# Altium schematic sheet XC7A35TFTG256_bank34.SchDoc
size A4; DocumentNumber: 19; SheetNumber: 19; SheetTotal: 21; SheetName: FPGA Bank 34
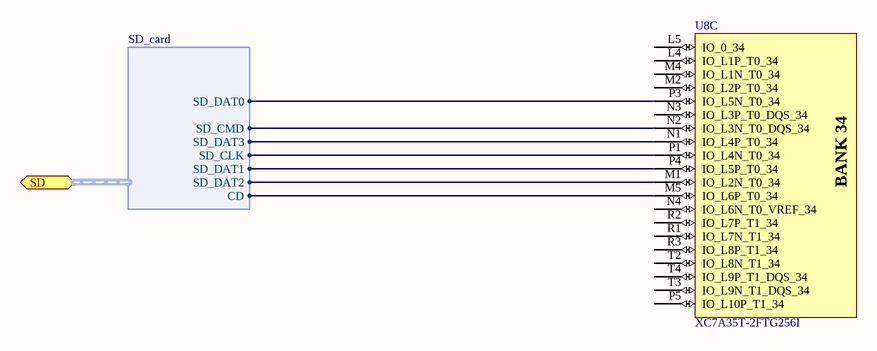
[diagram p0: XC7A35TFTG256_bank34.SchDoc]

## Parts
U8  XC7A35T-2FTG256I  [FTG256]  (part C of 8)

## Ports
SD (harness SD_card)

## Harnesses
SD_card: SD_CMD, SD_CLK, SD_DAT0, SD_DAT1, SD_DAT2, SD_DAT3, CD

## Nets
NetU8_M1: U8.M1(IO_L2N_T0_34) ; port SD.SD_DAT2
NetU8_M5: U8.M5(IO_L6P_T0_34) ; port SD.CD
NetU8_N1: U8.N1(IO_L4P_T0_34) ; port SD.SD_DAT3
NetU8_N2: U8.N2(IO_L3N_T0_DQS_34) ; port SD.SD_CMD
NetU8_P1: U8.P1(IO_L4N_T0_34) ; port SD.SD_CLK
NetU8_P3: U8.P3(IO_L5N_T0_34) ; port SD.SD_DAT0
NetU8_P4: U8.P4(IO_L5P_T0_34) ; port SD.SD_DAT1

Not connected (* = marked no-connect by the designer): U8 L4(IO_L1P_T0_34) L5(IO_0_34) M2(IO_L2P_T0_34) M4(IO_L1N_T0_34) N3(IO_L3P_T0_DQS_34) N4(IO_L6N_T0_VREF_34) P5(IO_L10P_T1_34) R1(IO_L7N_T1_34) R2(IO_L7P_T1_34) R3(IO_L8P_T1_34) T2(IO_L8N_T1_34) T3(IO_L9N_T1_DQS_34) T4(IO_L9P_T1_DQS_34)

## Notes on the sheet
- Board:
- Version:
- Sheetname:
- Subject:
- Group:
- Sheet
- of
- Shematic file:
- (in symbol CMP-0383-00025-1, part C) BANK 34

## Library data of the parts
U8 = CMP-0383-00025-1: Artix-7 FPGA, 170 User I/Os, 0 GTP, 256-Ball BGA, Speed Grade 2, Industrial Grade, Pb-Free; Manufacturer: Xilinx; Logic Cells: 33280; GTP: 0; CMTs: 5; Available User I/O: 170; Total Block RAM: 1800 Kb; Speed Grades: 2; ComponentLink3Description: Pinout; ComponentLink4Description: Package Specification; ComponentLink2URL: http://www.xilinx.com/support/documentation/data_sheets/ds180_7Series_Overview.pdf; DatasheetVersion: Rev. 1.15; PackageVersion: Rev. 1.11; ComponentLink3URL: http://www.xilinx.com/support/documentation/user_guides/ug475_7Series_Pkg_Pinout.pdf; ComponentLink1Description: Manufacturer URL; PackageReference: FTG-256; ComponentLink1URL: http://www.xilinx.com/; ComponentLink4URL: http://www.xilinx.com/support/documentation/user_guides/ug475_7Series_Pkg_Pinout.pdf; Mounting Technology: Surface Mount; Maximum Distributed RAM: 400 Kb; PackageDescription: 256-Ball Wire-Bond Fine-Pitch Thin BGA, Body 17 x 17 mm, Pitch 1 mm; ComponentLink2Description: Datasheet; Operating Temperature Range: Industrial; PartNumber: XC7A35T-2FTG256I; PartId: 1